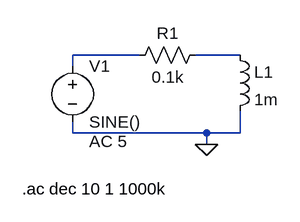
[diagram p0: schematic High Pass LR Filter.asc]
High Pass LR Filter.asc, the LTspice schematic file:
Version 4
SHEET 1 880 680
WIRE 112 96 16 96
WIRE 256 96 192 96
WIRE 16 112 16 96
WIRE 16 208 16 192
WIRE 208 208 16 208
WIRE 256 208 256 176
WIRE 256 208 208 208
WIRE 208 224 208 208
FLAG 208 224 0
SYMBOL voltage 16 96 R0
WINDOW 123 24 124 Left 2
WINDOW 39 0 0 Left 0
SYMATTR InstName V1
SYMATTR Value SINE()
SYMATTR Value2 AC 5
SYMBOL ind 240 80 R0
SYMATTR InstName L1
SYMATTR Value 1m
SYMBOL res 208 80 R90
WINDOW 0 0 56 VBottom 2
WINDOW 3 32 56 VTop 2
SYMATTR InstName R1
SYMATTR Value 0.1k
TEXT -56 288 Left 2 !.ac dec 10 1 1000k

The netlist it stands for:
* High Pass LR Filter.asc
V1 N001 0 SINE() AC 5
L1 N002 0 1m
R1 N002 N001 0.1k
.ac dec 10 1 1000k
.backanno
.end